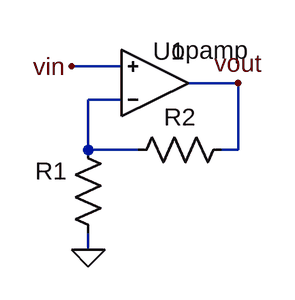
[diagram p0: schematic non_inverting_opamp.asc]
non_inverting_opamp.asc, the LTspice schematic file:
Version 4
SHEET 1 880 680
WIRE 176 112 128 112
WIRE 288 128 240 128
WIRE 176 144 144 144
WIRE 144 192 144 144
WIRE 192 192 144 192
WIRE 288 192 288 128
WIRE 288 192 272 192
WIRE 144 288 144 272
FLAG 144 288 0
FLAG 128 112 vin
FLAG 288 128 vout
SYMBOL OpAmps\\opamp 208 192 M180
WINDOW 0 -2 95 Left 2
SYMATTR InstName U1
SYMBOL res 160 288 R180
WINDOW 0 36 76 Left 2
WINDOW 3 36 40 Left 2
SYMATTR InstName R1
SYMATTR Value ""
SYMBOL res 288 176 R90
WINDOW 0 0 56 VBottom 2
WINDOW 3 32 56 VTop 2
SYMATTR InstName R2
SYMATTR Value ""

The netlist it stands for:
* non_inverting_opamp.asc
XU1 N001 vin vout opamp Aol=100K GBW=10Meg  ; pins invin noninvin out
R1 0 N001
R2 vout N001
.backanno
.end